# EasyEDA Pro project 4 Port AC Power Switch.eprj, schematic Schematic1

## Sheets
1 Power + Interface: Board Name: V3.0.0 4 Port; Create Date: 2026-02-01; Page Name: Power + Interface; Project Name: AC Power Switch; Schematic Name: Schematic1; Update Date: 2026-02-10; Company: EasyEDA.com; Page Size: A4; Version: V1.0
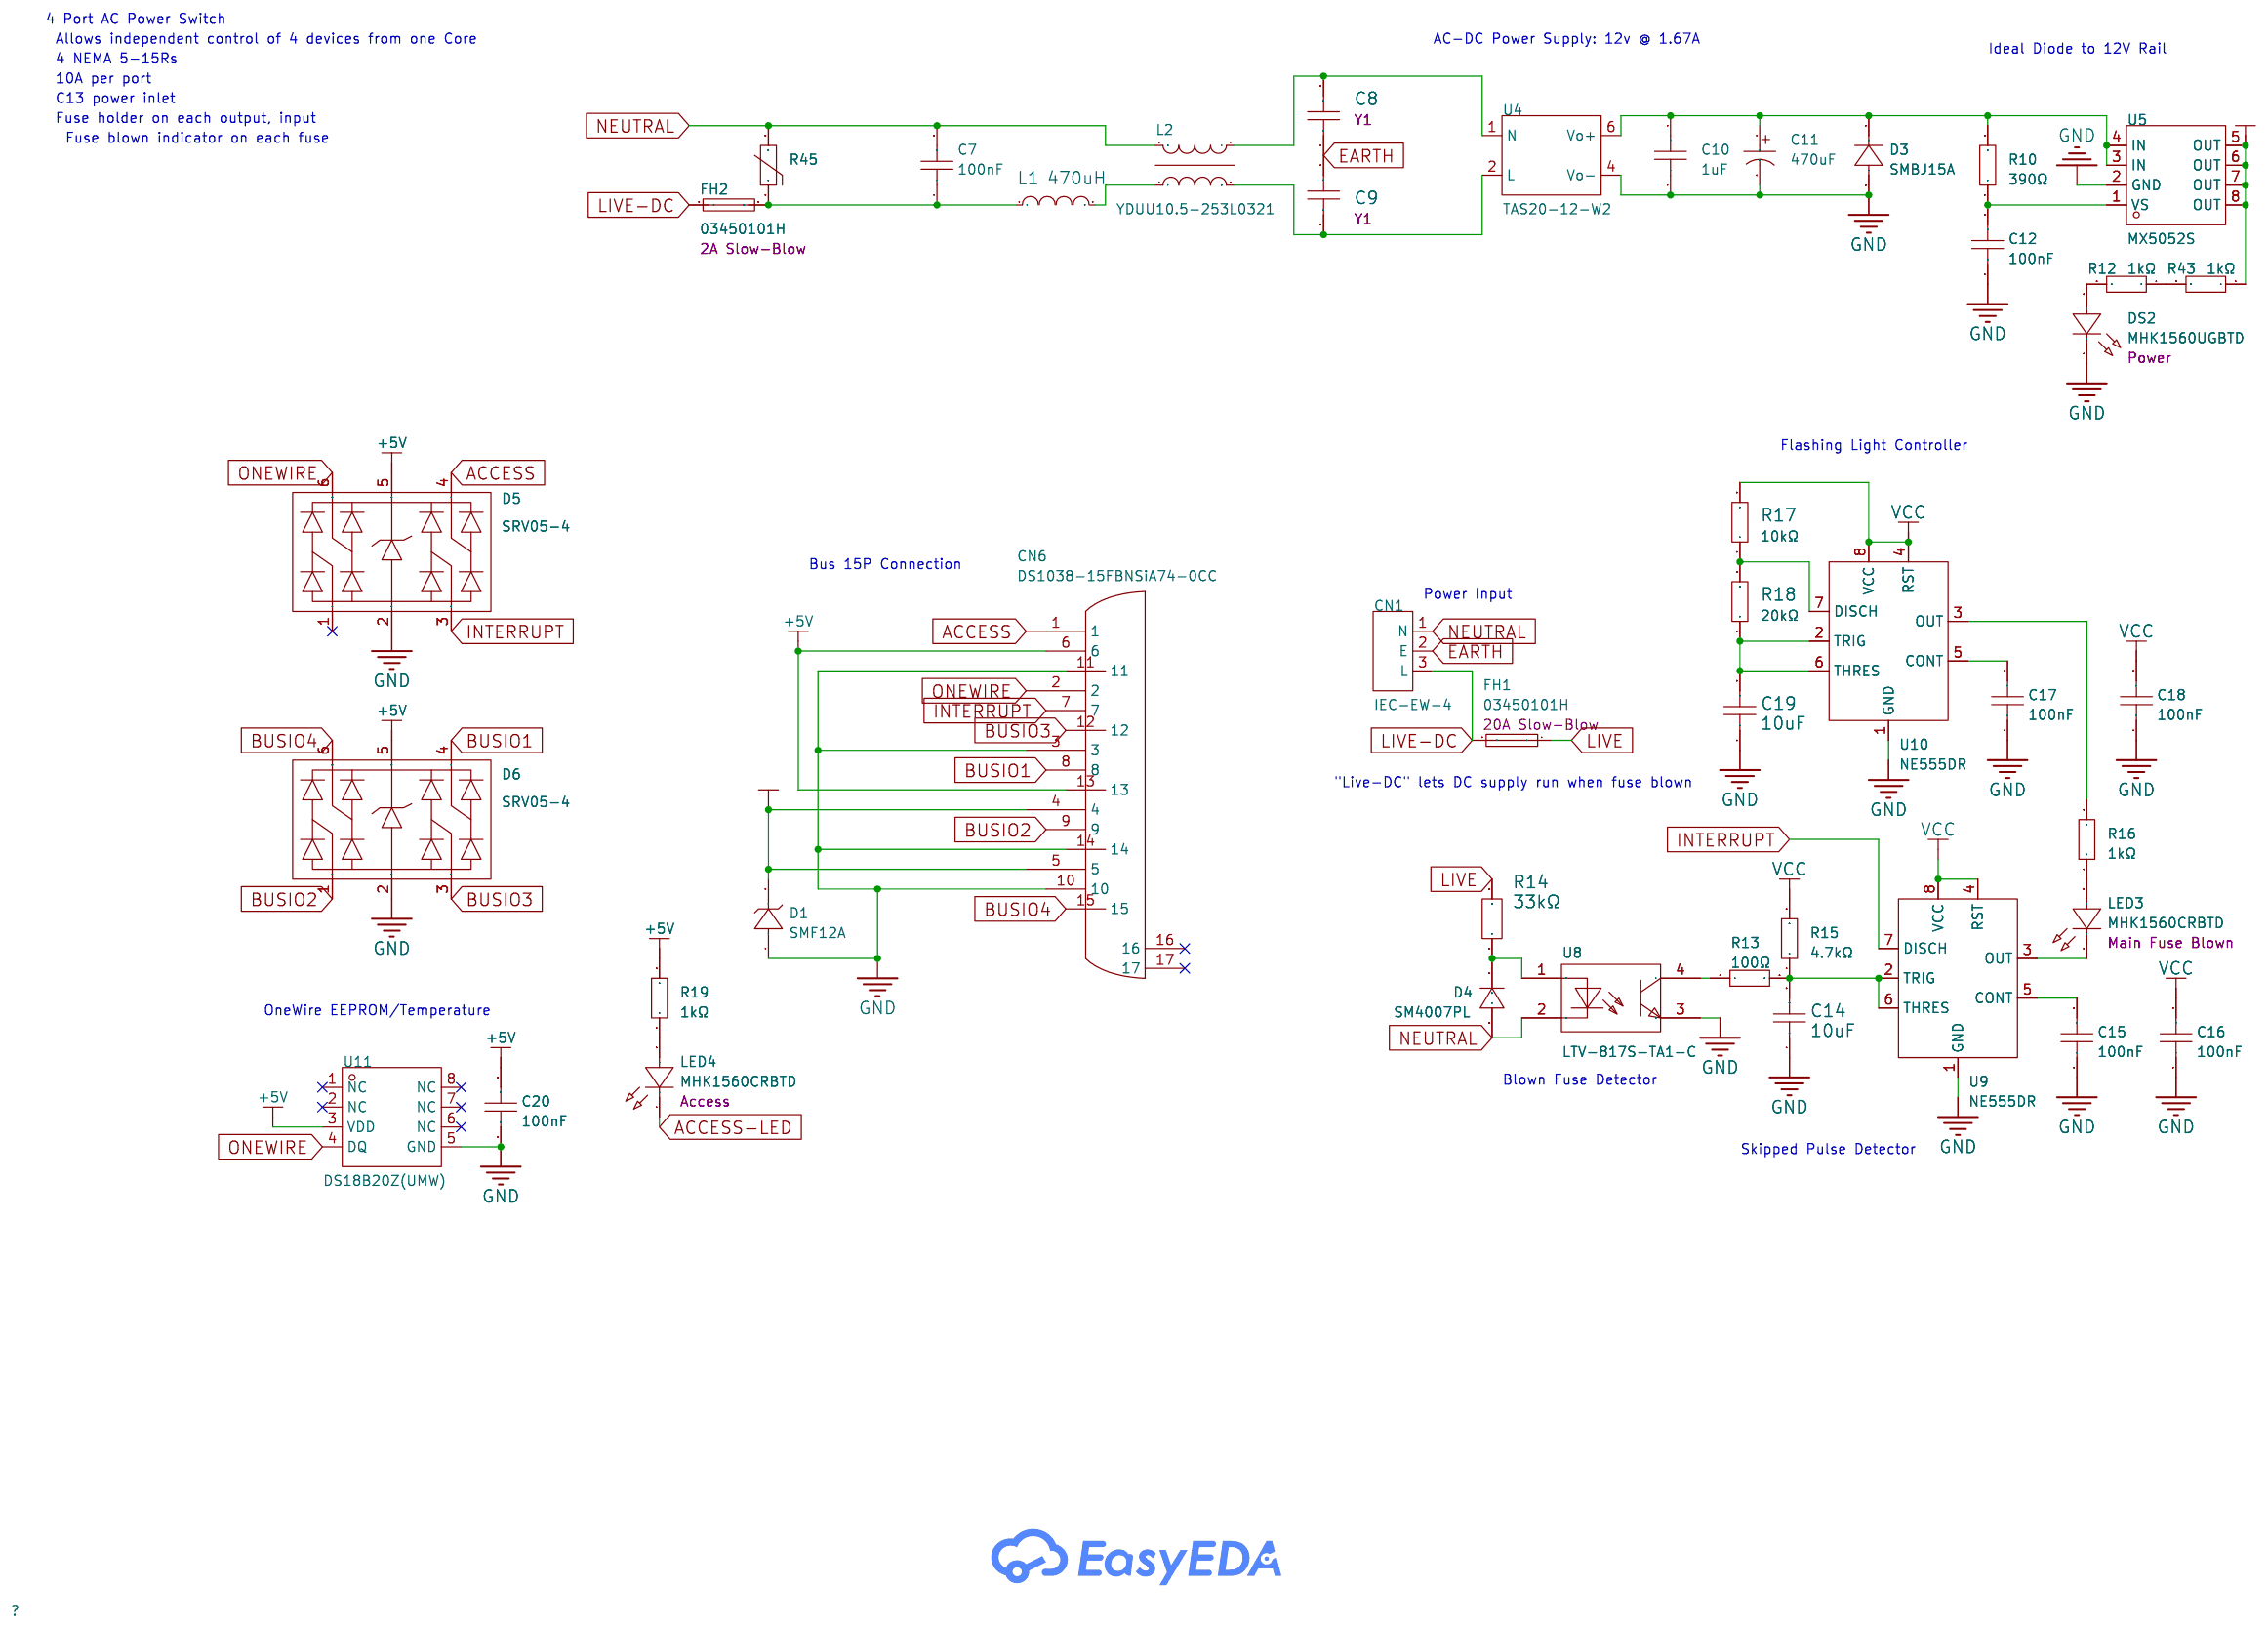
[diagram p0: Power + Interface]
2 Outputs: Create Date: 2026-02-08; Page Name: Outputs
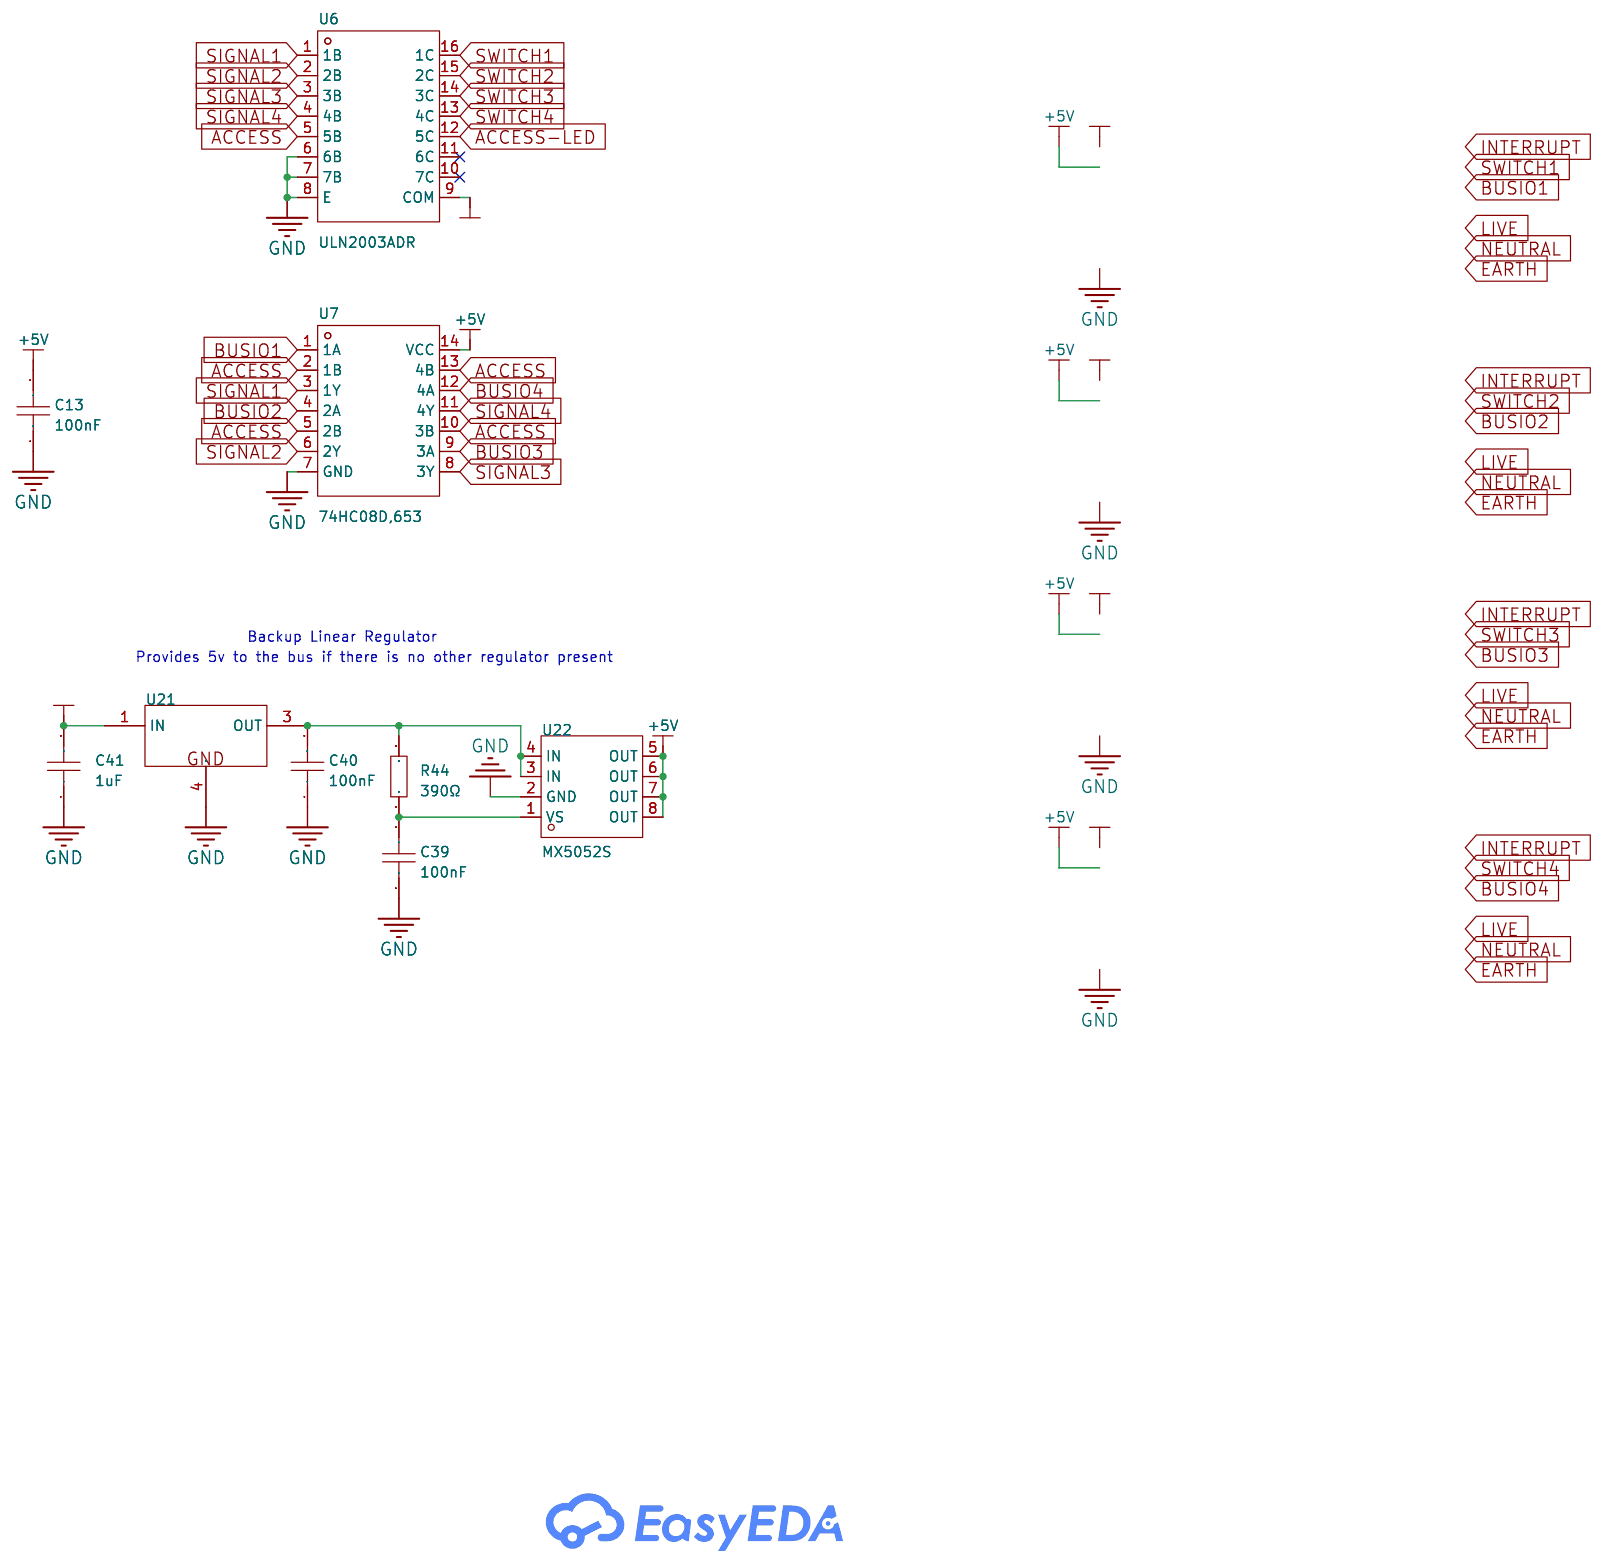
[diagram p1: Outputs]

## Parts
sheet Outputs
C13  100nF  [C0603]
C39  100nF  [C0603]
C40  100nF  [C0603]
C41  1uF  [C0603]
CBB1  -
CBB2  -
CBB3  -
CBB4  -
R44  390Ω  [R0805]
U6  ULN2003ADR  [SOIC-16_L9.9-W3.9-P1.27-LS6.0-BL]
U7  74HC08D,653  [SOIC-14_L8.7-W3.9-P1.27-LS6.0-BL]
U21  -  [TO-252-2_L6.5-W6.1-P4.58-LS10.0-TL]
U22  MX5052S  [SOP-8_L4.9-W3.9-P1.27-LS6.0-BL]
sheet Power + Interface
C7  100nF  [CAP-TH_L10.0-W5.0-P7.50-D0.6]
C8  1nF  [CAP-TH_L8.5-W5.0-P10.00-D0.6]
C9  1nF  [CAP-TH_L8.5-W5.0-P10.00-D0.6]
C10  1uF  [C0603]
C11  470uF  [CAP-TH_BD10.0-P5.00-D1.0-FD]
C12  100nF  [C0603]
C14  10uF  [C0603]
C15  100nF  [C0603]
C16  100nF  [C0603]
C17  100nF  [C0603]
C18  100nF  [C0603]
C19  10uF  [C0603]
C20  100nF  [C0603]
CN1  IEC-EW-4  [CONN-TH_IEC-EW-4]
CN6  DS1038-15FBNSiA74-0CC  [DSUB-TH_DS1038-15FBNSIA74-0CC]
D1  SMF12A  [SOD-123FL_L2.8-W1.8-LS3.8-R-RD]
D3  SMBJ15A  [SMB_L4.3-W3.6-LS5.3-RD]
D4  SM4007PL  [SOD-123F_L2.8-W1.8-LS3.7-RD]
D5  SRV05-4  [SOT-23-6_L2.9-W1.6-P0.95-LS2.8-BL]
D6  SRV05-4  [SOT-23-6_L2.9-W1.6-P0.95-LS2.8-BL]
DS2  MHK1560UGBTD  [LED-TH_MHK1560UGBTD]
FH1  03450101H  [03450101H]
FH2  03450101H  [03450101H]
L1  470uH  [IND-TH_BD9.0-P5.00-D0.7]
L2  YDUU10.5-253L0321  [IND-TH_4P-L19.0-W17.0]
LED3  MHK1560CRBTD  [LED-TH_L12.2-W6.0-P2.54]
LED4  MHK1560CRBTD  [LED-TH_L12.2-W6.0-P2.54]
R10  390Ω  [R0805]
R12  1kΩ  [R0603]
R13  100Ω  [R0603]
R14  33kΩ  [RES-TH_BD6.0-L17.5-P21.50-D0.8]
R15  4.7kΩ  [R0603]
R16  1kΩ  [R0603]
R17  10kΩ  [R0603]
R18  20kΩ  [R0603]
R19  1kΩ  [R0603]
R43  1kΩ  [R0603]
R45  210pF@1kHz  [RES-TH_L12.5-W5.1-P7.50-D1.2-S2.20]
U4  TAS20-12-W2  [PWRM-TH_4P-L39.0-W25.0_TAS12-15-W2]
U5  MX5052S  [SOP-8_L4.9-W3.9-P1.27-LS6.0-BL]
U8  LTV-817S-TA1-C  [OPTO-SMD-4_L4.6-W6.5-P2.54-LS10.3-BL]
U9  NE555DR  [SOIC-8_L4.9-W3.9-P1.27-LS6.0-BL]
U10  NE555DR  [SOIC-8_L4.9-W3.9-P1.27-LS6.0-BL]
U11  DS18B20Z(UMW)  [SOP-8_L4.9-W3.9-P1.27-LS6.0-BL]

## Library data of the parts
C12 C13 C15-C18 C20 C39 C40 = CC0603KRX7R9BB104: LCSC Part Name: 100nF ±10% 50V; Supplier Part: C14663; Manufacturer: YAGEO(国巨); Supplier Footprint: 0603; Datasheet: https://item.szlcsc.com/datasheet/CC0603KRX7R9BB104/15331.html; Supplier: LCSC; Tolerance: ±10%; Voltage Rating: 50V; Temperature Coefficient: X7R
C10 C41 = CL10A105KB8NNNC: LCSC Part Name: 1uF ±10% 50V; Supplier Part: C15849; Manufacturer: SAMSUNG(三星); Supplier Footprint: 0603; JLCPCB Part Class: Basic Part; Datasheet: https://item.szlcsc.com/datasheet/CL10A105KB8NNNC/16531.html; Supplier: LCSC; Tolerance: ±10%; Voltage Rating: 50V; Temperature Coefficient: X5R
R10 R44 = 0805W8F3900T5E: Type:Thick Film Resistor Resistance:390Ω Tolerance:±1% Tolerance:±1% Power(Watts):125mW Voltage-Supply(Max):150V Temperature Coefficient:±100ppm/℃ Temperature Coefficient:±100ppm/℃ Operating Temperature:-55℃~+155℃ Operating Temperature:-55℃~+155℃; LCSC Part Name: 390Ω ±1% 125mW 厚膜电阻; Supplier Part: C17655; Manufacturer: UNI-ROYAL(厚声); Supplier Footprint: 0805; Datasheet: https://item.szlcsc.com/datasheet/0805W8F3900T5E/18343.html; Supplier: LCSC; Type: Thick Film Resistor; Tolerance: ±1%; Power(Watts): 125mW; Voltage-Supply(Max): 150V; Temperature Coefficient: ±100ppm/℃; Operating Temperature: -55℃~+155℃
U6 = ULN2003ADR: LCSC Part Name: 高压、大电流达林顿晶体管阵列; Supplier Part: C7512; Manufacturer: TI(德州仪器); Supplier Footprint: SOIC-16; Datasheet: https://www.ti.com/cn/lit/gpn/uln2003a; Supplier: LCSC; number of channels: 7; Collector - Emitter Voltage VCEO: 50V; Current - Collector(Ic): 500mA; Voltage - Input(Max): 30V; Output Leakage Current(Icex): 50uA; Voltage - Forward(Vf): 1.7V; Reverse Leakage Current (Ir): 50uA; Input Capacitiance(Ci): 15pF
U7 = 74HC08D,653: LCSC Part Name: 四路二输入与门; Supplier Part: C5593; Manufacturer: Nexperia(安世); Supplier Footprint: SOIC-14; Datasheet: https://item.szlcsc.com/datasheet/74HC08D%252C653/6044.html; Supplier: LCSC; Logic Type: AND Gate; Number of Channels: 4; Voltage - Supply: 2V~6V; Quiescent Current: 2uA; Current - Output Low(IOL): 5.2mA; Current - Output High(IOH): 5.2mA; Input Logic Level - High: 1.5V~4.2V; Input Logic Level - Low: 500mV~1.8V; Output Logic Level - High: 3.7V；1.9V；5.2V; Output Logic Level - Low: 100mV；400mV; Series: 74HC Series; Propagation Delay: 27ns@4.5V,50pF; Operating Temperature: -40℃~+125℃; Input Number: 2
U21 = L78M05ABDT-TR: LCSC Part Name: Vin=35V Vout=5V 500mA 62dB@(120Hz); Supplier Part: C58069; Manufacturer: ST(意法半导体); Supplier Footprint: TO-252-2(DPAK); JLCPCB Part Class: Basic Part; Datasheet: https://atta.szlcsc.com/upload/public/pdf/source/20150912/1457707362652.pdf; Supplier: LCSC; Output Polarity: Positive; Number of Outputs: 1; Maximum Input Voltage: 35V; Output Voltage: 5V~5V; Output Current: 500mA; Power Supply Rejection Ratio (PRSS): 62dB@(120Hz)
U5 U22 = MX5052S: LCSC Part Name: 集成MOS Oring控制器; Supplier Part: C5875696; Manufacturer: Wuxi Maxinmicro(无锡明芯微); Supplier Footprint: SOP-8; JLCPCB Part Class: Extended Part; Datasheet: https://item.szlcsc.com/datasheet/MX5052S/6809525.html; Supplier: LCSC
C7 = PX104K2C0702: LCSC Part Name: 等级:X2 100nF ±10% 310V 350V 380V; Supplier Part: C2693793; Manufacturer: KYET(科雅); Supplier Footprint: 插件,P=7.5mm; JLCPCB Part Class: Extended Part; Datasheet: https://item.szlcsc.com/datasheet/PX104K2C0702/2809868.html; Supplier: LCSC; Tolerance: ±10%; Voltage(AC): 310V；380V；350V; Ratings: X2; Operating Temperature: -40℃~+110℃
C8 C9 = VY1102M31Y5UC63V0: LCSC Part Name: 等级:X1,Y1 1nF ±20% 760V; Supplier Part: C1620957; Manufacturer: VISHAY(威世); Supplier Footprint: 插件,P=10mm; JLCPCB Part Class: Extended Part; Datasheet: https://item.szlcsc.com/datasheet/VY1102M31Y5UC63V0/1711803.html; Supplier: LCSC; Tolerance: ±20%; Voltage(AC): 760V; Ratings: Y1; Operating Temperature: -40℃~+125℃
C11 = KM477M025G13RR0VH2FP0: LCSC Part Name: 470uF ±20% 25V; Supplier Part: C44594; Manufacturer: Chengx(承兴); Supplier Footprint: 插件,D10xL13mm; JLCPCB Part Class: Extended Part; Datasheet: https://item.szlcsc.com/datasheet/KM477M025G13RR0VH2FP0/45596.html; Supplier: LCSC; Tolerance: ±20%; Voltage Rating: 25V; Pin Spacing: 5mm; Diameter: 10mm; Height - Seated (Max): 13mm; Lifetime: 2000hrs@105℃
C14 C19 = CL10A106MA8NRNC: LCSC Part Name: 10uF ±20% 25V; Supplier Part: C96446; Manufacturer: SAMSUNG(三星); Supplier Footprint: 0603; Datasheet: https://item.szlcsc.com/datasheet/CL10A106MA8NRNC/97651.html; Supplier: LCSC; Tolerance: ±20%; Voltage Rating: 25V; Temperature Coefficient: X5R
CN1 = IEC-EW-4: Supplier Part: C17684530; Manufacturer: ADAM TECH; Datasheet: https://item.szlcsc.com/datasheet/IEC-EW-4/18813803.html; Supplier: LCSC
CN6 = DS1038-15FBNSiA74-0CC: Connector Type:High Density D-Sub Gender:Female Number of Pins:15P Mounting Type:Right Angle Number of Rows:3 Current Rating-Signal:3A Current Rating-Power:- Voltage Rating:- Color:Black Operating Temperature:-40℃~+105℃ Operating Temperature:-40℃~+105℃; LCSC Part Name: 黑色 1000/盒 D-Sub 母 P数:15P; Supplier Part: C75754; Manufacturer: CONNFLY; Supplier Footprint: 弯插; JLCPCB Part Class: Extended Part; Datasheet: https://item.szlcsc.com/datasheet/DS1038-15FBNSiA74-0CC/76880.html; Supplier: LCSC; Connector Type: High Density D-Sub; Gender: Female; Number of Pins: 15P; Mounting Type: Right Angle; Number of Rows: 3; Current Rating-Signal: 3A; Color: Black; Operating Temperature: -40℃~+105℃
D1 = SMF12A_C19077506: LCSC Part Name: 单向TVS 12V截止 峰值浪涌电流：10.1A@10/1000us; Supplier Part: C19077506; Manufacturer: R+O(宏嘉诚); Supplier Footprint: SOD-123FL; Datasheet: https://item.szlcsc.com/datasheet/SMF12A/20275591.html; Supplier: LCSC; Polarity: Unidirectional; Reverse Stand-Off Voltage (Vrwm): 12V; Clamping Voltage: 19.9V; Peak Pulse Current (Ipp): 10.1A@10/1000us; Peak Pulse Power Dissipation (Ppp): 200W@10/1000us; Voltage - Breakdown: 14.7V; Reverse Leakage Current (Ir): 2.5uA; Operating Temperature: -55℃~+150℃; level of protection: IEC 61000-4-2; Type: TVS
D3 = SMBJ15A_C19077569: LCSC Part Name: 单向TVS 15V截止 峰值浪涌电流：24.59A@10/1000us; Supplier Part: C19077569; Manufacturer: R+O(宏嘉诚); Supplier Footprint: DO-214AA(SMB); JLCPCB Part Class: Extended Part; Datasheet: https://item.szlcsc.com/datasheet/SMBJ15A/20275654.html; Supplier: LCSC; Polarity: Unidirectional; Reverse Stand-Off Voltage (Vrwm): 15V; Clamping Voltage: 24.4V; Peak Pulse Current (Ipp): 24.59A@10/1000us; Peak Pulse Power Dissipation (Ppp): 600W@10/1000us; Voltage - Breakdown: 18.5V; Reverse Leakage Current (Ir): 5uA; Operating Temperature: -55℃~+150℃; level of protection: IEC 61000-4-2; Type: TVS
D4 = SM4007PL_C64898: LCSC Part Name: 1kV 1A; Supplier Part: C64898; Manufacturer: MDD(辰达半导体); Supplier Footprint: SOD-123FL; Datasheet: https://item.szlcsc.com/datasheet/SM4007PL/65968.html; Supplier: LCSC; Diode Configuration: Independent; Voltage - Forward(Vf@If): 1.1V@1A; Voltage - DC Reverse(Vr): 1kV; Current - Rectified: 1A; Reverse Leakage Current (Ir): 10uA@1kV; Non-Repetitive Peak Forward Surge Current: 25A; Operating Junction Temperature Range: -55℃~+150℃
D5 D6 = SRV05-4_C558418: LCSC Part Name: 单向ESD 5V截止 峰值脉冲电流：3A; Supplier Part: C558418; Manufacturer: TECH PUBLIC(台舟); Supplier Footprint: SOT-23-6; Datasheet: https://item.szlcsc.com/datasheet/SRV05-4/581825.html; Supplier: LCSC; Polarity: Unidirectional; Reverse Stand-Off Voltage (Vrwm): 5V; Clamping Voltage: 20V; Peak Pulse Current (Ipp): 3A; Peak Pulse Power Dissipation (Ppp): 60W; Voltage - Breakdown: 6V; Reverse Leakage Current (Ir): 500nA; Number of Channels: 4; Operating Temperature: -55℃~+125℃; level of protection: IEC 61000-4-2；IEC 61000-4-4；IEC 61000-4-5; Type: ESD; Junction Capacitance: 0.8pF；0.3pF
DS2 = MHK1560UGBTD: Emitted Color:Emerald Forward Voltage (VF):1.75V~2.2V Forward Voltage (VF):1.75V~2.2V Forward Current:20mA Dominant Wavelength:520nm Dominant Wavelength:520nm Lens Color:雾状绿透镜 Luminous Intensity:1000mcd Luminous Intensity:1000mcd Viewing Angle:85° Operati; LCSC Part Name: 1560直插单灯翠绿色光; Supplier Part: C7470833; Manufacturer: MEIHUA(美华); Supplier Footprint: 插件,P=2.54mm; JLCPCB Part Class: Extended Part; Datasheet: https://atta.szlcsc.com/upload/public/pdf/source/20231114/0151DB1F997DCF286213A722D08B4BAA.pdf; Supplier: LCSC; Emitted Color: Emerald; Forward Voltage (VF): 1.75V~2.2V; Forward Current: 20mA; Dominant Wavelength: 520nm; Lens Color: 雾状绿透镜; Luminous Intensity: 1000mcd; Viewing Angle: 85°; Operating Temperature: -40℃~+85℃; Note: Power
FH1 = 03450101H: LCSC Part Name: 20A 600V; Supplier Part: C206934; Manufacturer: Littelfuse(美国力特); Datasheet: https://item.szlcsc.com/datasheet/03450101H/208053.html; Supplier: LCSC; Number of Circuits: 1; Voltage Rating: 600V; Current Rating: 20A; Fuse Type: Cylindrical; Fuse Diameter (φD): 6.35mm; Fuse Length: 32mm; Note: 20A Slow-Blow
FH2 = 03450101H: LCSC Part Name: 20A 600V; Supplier Part: C206934; Manufacturer: Littelfuse(美国力特); Datasheet: https://item.szlcsc.com/datasheet/03450101H/208053.html; Supplier: LCSC; Number of Circuits: 1; Voltage Rating: 600V; Current Rating: 20A; Fuse Type: Cylindrical; Fuse Diameter (φD): 6.35mm; Fuse Length: 32mm; Note: 2A Slow-Blow
L1 = PK0810-471MB: LCSC Part Name: 470uH ±20%; Supplier Part: C400319; Manufacturer: SXN(顺翔诺); Supplier Footprint: 插件,D10xL13mm; JLCPCB Part Class: Extended Part; Datasheet: https://item.szlcsc.com/datasheet/PK0810-471MB/384150.html; Supplier: LCSC; Tolerance: ±20%; Current Rating: 420mA; DC Resistance(DCR): 800mΩ; Type: Unshielded Inductor
L2 = YDUU10.5-253L0321: LCSC Part Name: UU10.5 25mH @1KHz; Supplier Part: C5200263; Manufacturer: YJYCOIN(益嘉源); Supplier Footprint: 插件,19x17mm; JLCPCB Part Class: Extended Part; Datasheet: https://item.szlcsc.com/datasheet/YDUU10.5-253L0321/5887401.html; Supplier: LCSC; Number of Lines: 2; Inductance @ Frequency: 25mH@1KHz; Voltage Withstand: 1.5kV@AC
LED3 = MHK1560CRBTD: LCSC Part Name: 1560直插单灯红色光; Supplier Part: C7470835; Manufacturer: MEIHUA(美华); Supplier Footprint: 插件,P=2.54mm; JLCPCB Part Class: Extended Part; Datasheet: https://item.szlcsc.com/datasheet/MHK1560CRBTD/8521940.html; Supplier: LCSC; Illumination Color: Red; Voltage - Forward(Vf): 1.75V~2.2V; Power(Watts): 80mW; Forward Current: 20mA; Wavelength - Dominant: 632nm; Lens Color: Diffused Red Lens; Luminous Intensity: 50mcd; Viewing Angle: 85°; Operating Temperature: -40℃~+85℃; Note: Main Fuse Blown
LED4 = MHK1560CRBTD: LCSC Part Name: 1560直插单灯红色光; Supplier Part: C7470835; Manufacturer: MEIHUA(美华); Supplier Footprint: 插件,P=2.54mm; JLCPCB Part Class: Extended Part; Datasheet: https://item.szlcsc.com/datasheet/MHK1560CRBTD/8521940.html; Supplier: LCSC; Illumination Color: Red; Voltage - Forward(Vf): 1.75V~2.2V; Power(Watts): 80mW; Forward Current: 20mA; Wavelength - Dominant: 632nm; Lens Color: Diffused Red Lens; Luminous Intensity: 50mcd; Viewing Angle: 85°; Operating Temperature: -40℃~+85℃; Note: Access
R12 R16 R19 R43 = 0603WAF1001T5E: LCSC Part Name: 1kΩ ±1% 100mW 厚膜电阻; Supplier Part: C21190; Manufacturer: UNI-ROYAL(厚声); Supplier Footprint: 0603; Datasheet: https://item.szlcsc.com/datasheet/0603WAF1001T5E/21904.html; Supplier: LCSC; Type: Thick Film Resistor; Tolerance: ±1%; Power(Watts): 100mW; Voltage-Supply(Max): 75V; Temperature Coefficient: ±100ppm/℃; Operating Temperature: -55℃~+155℃
R13 = 0603WAF1000T5E: LCSC Part Name: 100Ω ±1% 100mW 厚膜电阻; Supplier Part: C22775; Manufacturer: UNI-ROYAL(厚声); Supplier Footprint: 0603; Datasheet: https://atta.szlcsc.com/upload/public/pdf/source/20200306/C422600_1E6D84923E4A46A82E41ADD87F860B5C.pdf; Supplier: LCSC; Type: Thick Film Resistors; Tolerance: ±1%; Temperature Coefficient: ±200ppm/℃; Operating Temperature Range: -55℃~+155℃
R14 = MOR03WJ0333AA0: LCSC Part Name: 33kΩ ±5% 3W; Supplier Part: C7422263; Manufacturer: UNI-ROYAL(厚声); Supplier Footprint: 插件,D6xL17.5mm; Datasheet: https://item.szlcsc.com/datasheet/MOR03WJ0333AA0/8404660.html; Supplier: LCSC; Tolerance: ±5%; Voltage-Supply(Max): 500V; Power(Watts): 3W
R15 = 0603WAF4701T5E: LCSC Part Name: 4.7kΩ ±1% 100mW 厚膜电阻; Supplier Part: C23162; Manufacturer: UNI-ROYAL(厚声); Supplier Footprint: 0603; Datasheet: https://item.szlcsc.com/datasheet/0603WAF4701T5E/23889.html; Supplier: LCSC; Type: Thick Film Resistor; Tolerance: ±1%; Power(Watts): 100mW; Voltage-Supply(Max): 75V; Temperature Coefficient: ±100ppm/℃; Operating Temperature: -55℃~+155℃
R17 = 0603WAF1002T5E: LCSC Part Name: 厚膜电阻 10kΩ ±1% 100mW; Supplier Part: C25804; Manufacturer: UNI-ROYAL(厚声); Supplier Footprint: 0603; JLCPCB Part Class: Basic Part; Datasheet: https://item.szlcsc.com/datasheet/0603WAF1002T5E/26547.html; Supplier: LCSC; Type: Thick Film Resistor; Tolerance: ±1%; Power(Watts): 100mW; Voltage-Supply(Max): 75V; Temperature Coefficient: ±100ppm/℃; Operating Temperature: -55℃~+155℃
R18 = 0603WAF2002T5E: LCSC Part Name: 20kΩ ±1% 100mW 厚膜电阻; Supplier Part: C4184; Manufacturer: UNI-ROYAL(厚声); Supplier Footprint: 0603; Datasheet: https://item.szlcsc.com/datasheet/0603WAF2002T5E/4591.html; Supplier: LCSC; Type: Thick Film Resistor; Tolerance: ±1%; Power(Watts): 100mW; Voltage-Supply(Max): 75V; Temperature Coefficient: ±100ppm/℃; Operating Temperature: -55℃~+155℃
R45 = VDR-10D471K: LCSC Part Name: 钳位电压775V 67焦耳 插件压敏电阻; Supplier Part: C316609; Manufacturer: VDR(嵩隆); Supplier Footprint: 插件,P=7.5mm; JLCPCB Part Class: Extended Part; Datasheet: https://item.szlcsc.com/datasheet/VDR-10D471K/298277.html; Supplier: LCSC; Varistor Voltage: 423V~517V; Clamping Voltage: 775V; Maximum DC Volts: 385V; Maximum AC Volts: 300V; Peak Current: 2.5kA; Energy: 67J; Rated Wattage: 400mW
U4 = TAS20-12-W2: LCSC Part Name: 小体积AC-DC电源模块; Supplier Part: C39846906; Manufacturer: TDPOWER(腾达电源); Supplier Footprint: 插件,39x25mm; JLCPCB Part Class: Extended Part; Datasheet: https://item.szlcsc.com/datasheet/TAS20-12-W2/41578643.html; Supplier: LCSC; Conversion Type: AC/DC-DC; Number of Outputs: 1; Voltage - Input(DC): 100V~370V; Voltage - Input(AC): 85VAC~265VAC; Output Voltage: 12V; Output Voltage Accuracy: ±2%; Output Current(Max): 1.67A; Output Power: 20W; Quiescent Dissipation: 0.15W; Conversion Efficiency: 88%; Ripple Noise: 100mVp-p; Capacitive Load(Max): 3300uF; Features: Over Current Protection；Short Circuit Protection; Isolation Voltage(Vrms): 2.5kV; Length: 39mm; Width: 25mm; Height: 21mm; Switching Frequency: 100kHz
U8 = LTV-817S-TA1-C: LCSC Part Name: DC输入 隔离电压(rms):5000V; Supplier Part: C109227; Manufacturer: LITEON(光宝); Supplier Footprint: SMD-4P; Datasheet: https://item.szlcsc.com/datasheet/LTV-817S-TA1-C/110448.html; Supplier: LCSC; Input type: DC; Output Type: Phototransistor; Voltage - Forward(Vf): 1.2V; Output Current: 50mA; Isolation Voltage(Vrms): 5kV; Reverse Voltage: 6V; Load Voltage: 35V; Number of Outputs: 1; Vce Saturation(VCE(sat)): 100mV@1mA,20mA; Rise time: 4us@2mA,100Ω; Fall time: 3us; Operating Temperature: -30℃~+110℃; Current Transfer Ratio (CTR) Minimum: 50%; Current Transfer Ratio (CTR) Maximum/Saturation Value: 600%; Forward Current(If): 50mA
U9 U10 = NE555DR: Supplier Part: C7593; Manufacturer: TI(德州仪器); Supplier Footprint: SOIC-8; Datasheet: https://www.ti.com/cn/lit/gpn/sa555; Supplier: LCSC
U11 = DS18B20Z(UMW): LCSC Part Name: 温度传感器; Supplier Part: C695837; Manufacturer: UMW(友台半导体); Supplier Footprint: SOIC-8; JLCPCB Part Class: Extended Part; Datasheet: https://atta.szlcsc.com/upload/public/pdf/source/20241210/329D6A12FB6ADF2EBB286F6D44242ED4.pdf; Supplier: LCSC; Resolution: ±0.4℃; Supply Voltage: 2.5V~5.5V

## Nets
+5V: C13.2 C20.2 CBB1.2(VCC) CBB2.2(VCC) CBB3.2(VCC) CBB4.2(VCC) CN6.6 CN6.13 D5.5 D6.5 R19.2 U7.14(VCC) U11.3(VDD) U22.5(OUT) U22.6(OUT) U22.7(OUT) U22.8(OUT)
+12V: C41.2 CBB1.1(RELAY-POWER) CBB2.1(RELAY-POWER) CBB3.1(RELAY-POWER) CBB4.1(RELAY-POWER) CN6.4 CN6.5 D1.2(K) R43.1 U5.5(OUT) U5.6(OUT) U5.7(OUT) U5.8(OUT) U6.9(COM) U21.1(IN)
GND: C10.1 C11.2 C12.1 C13.1 C14.1 C15.1 C16.1 C17.1 C18.1 C19.1 C20.1 C39.1 C40.1 C41.1 CBB1.3(GND) CBB2.3(GND) CBB3.3(GND) CBB4.3(GND) CN6.3 CN6.10 CN6.11 CN6.14 D1.1(A) D3.2(A) D5.2 D6.2 DS2.1(K) U4.4(Vo-) U5.2(GND) U6.6(6B) U6.7(7B) U6.8(E) U7.7(GND) U8.3 U9.1(GND) U10.1(GND) U11.5(GND) U21.4(GND) U22.2(GND)
VCC: C16.2 C18.2 R15.2 R17.2 U9.4(RST) U9.8(VCC) U10.4(RST) U10.8(VCC)
ACCESS: CN6.1 D5.4 U6.5(5B) U7.2(1B) U7.5(2B) U7.10(3B) U7.13(4B)
ACCESS-LED: LED4.1(K) U6.12(5C)
BUSIO1: CBB1.9(LED) CN6.8 D6.4 U7.1(1A)
BUSIO2: CBB2.9(LED) CN6.9 D6.1 U7.4(2A)
BUSIO3: CBB3.9(LED) CN6.12 D6.3 U7.9(3A)
BUSIO4: CBB4.9(LED) CN6.15 D6.6 U7.12(4A)
EARTH: C8.1 C9.2 CBB1.8(EARTH) CBB2.8(EARTH) CBB3.8(EARTH) CBB4.8(EARTH) CN1.2(E)
INTERRUPT: CBB1.4(INTERRUPT) CBB2.4(INTERRUPT) CBB3.4(INTERRUPT) CBB4.4(INTERRUPT) CN6.7 D5.3 U9.7(DISCH)
LIVE: CBB1.6(LIVE) CBB2.6(LIVE) CBB3.6(LIVE) CBB4.6(LIVE) FH1.1 R14.2
LIVE-DC: CN1.3(L) FH1.2 FH2.1
NEUTRAL: C7.2 CBB1.7(NEUTRAL) CBB2.7(NEUTRAL) CBB3.7(NEUTRAL) CBB4.7(NEUTRAL) CN1.1(N) D4.2(A) L2.2 R45.2 U8.2
ONEWIRE: CN6.2 D5.6 U11.4(DQ)
SIGNAL1: U6.1(1B) U7.3(1Y)
SIGNAL2: U6.2(2B) U7.6(2Y)
SIGNAL3: U6.3(3B) U7.8(3Y)
SIGNAL4: U6.4(4B) U7.11(4Y)
SWITCH1: CBB1.5(SWITCH) U6.16(1C)
SWITCH2: CBB2.5(SWITCH) U6.15(2C)
SWITCH3: CBB3.5(SWITCH) U6.14(3C)
SWITCH4: CBB4.5(SWITCH) U6.13(4C)
$1N921: C10.2 C11.1 D3.1(K) R10.2 U4.6(Vo+) U5.3(IN) U5.4(IN)
$1N923: C9.1 L2.3 U4.2(L)
$1N926: C12.2 R10.1 U5.1(VS)
$1N928: DS2.2(A) R12.2
$1N930: C8.2 L2.4 U4.1(N)
$1N932: L1.2 L2.1
$1N933: C7.1 FH2.2 L1.1 R45.1
$1N2322: R13.1 U8.4
$1N2324: D4.1(C) R14.1 U8.1
$1N2329: C15.2 U9.5(CONT)
$1N2332: R16.2 U10.3(OUT)
$1N2333: C17.2 U10.5(CONT)
$1N2336: LED3.2(A) R16.1
$1N2337: LED3.1(K) U9.3(OUT)
$1N2343: C14.2 R13.2 R15.1 U9.2(TRIG) U9.6(THRES)
$1N2344: C19.2 R18.1 U10.2(TRIG) U10.6(THRES)
$1N2346: R17.1 R18.2 U10.7(DISCH)
$1N3488: LED4.2(A) R19.1
$1N6490: R12.1 R43.2
$2N4049: C40.2 R44.2 U21.3(OUT) U22.3(IN) U22.4(IN)
$2N4050: C39.2 R44.1 U22.1(VS)

Not connected (* = marked no-connect by the designer): CN6 16* 17*; D5 1*; U6 10(7C)* 11(6C)*; U11 1(NC)* 2(NC)* 6(NC)* 7(NC)* 8(NC)*

## Notes on the sheets
sheet 1
- 4 Port AC Power Switch
- Allows independent control of 4 devices from one Core
- AC-DC Power Supply: 12v @ 1.67A
- 4 NEMA 5-15Rs
- Ideal Diode to 12V Rail
- 10A per port
- C13 power inlet
- Fuse holder on each output, input
- Fuse blown indicator on each fuse
- Flashing Light Controller
- Bus 15P Connection
- Power Input
- "Live-DC" lets DC supply run when fuse blown
- OneWire EEPROM/Temperature
- Blown Fuse Detector
- Skipped Pulse Detector
sheet 2
- Backup Linear Regulator
- Provides 5v to the bus if there is no other regulator present
